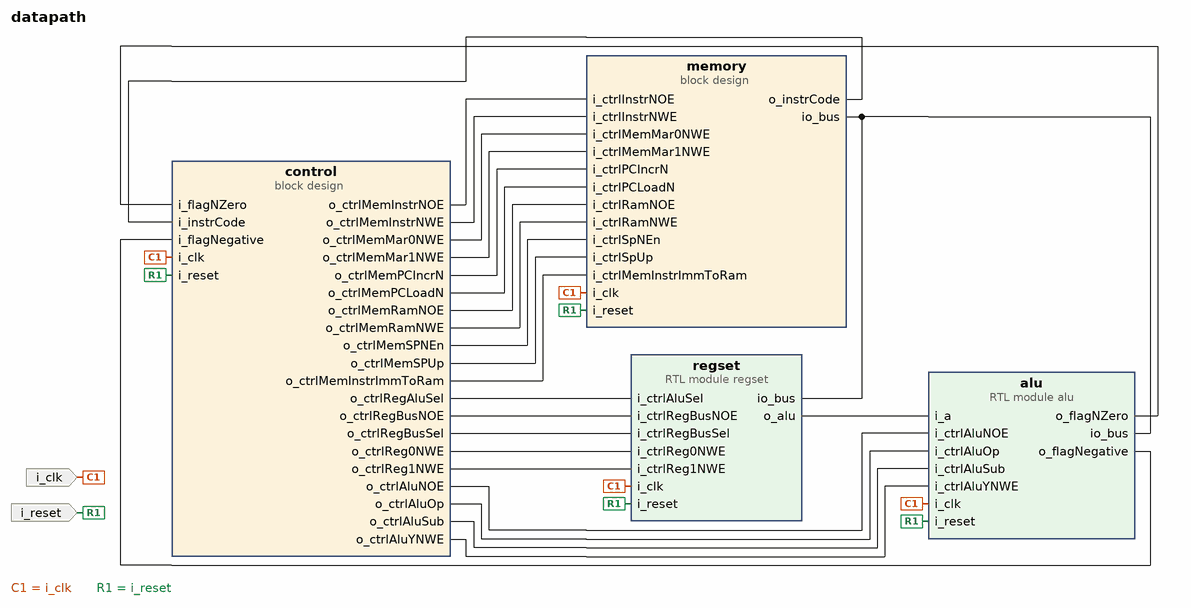
[diagram p0: block diagram of the top level]
# Vivado block design datapath, xc7a100tcsg324-3, Vivado 2021.1
create_bd_design datapath

create_bd_port -dir I -type clk i_clk
set_property -dict {CONFIG.PHASE 0.000} [get_bd_ports i_clk]
create_bd_port -dir I -type rst i_reset
set_property -dict {CONFIG.POLARITY ACTIVE_HIGH} [get_bd_ports i_reset]

create_bd_cell -type container -reference memory_bd memory
set_property -dict [list \
  CONFIG.ACTIVE_SIM_BD memory_bd.bd \
  CONFIG.ACTIVE_SYNTH_BD memory_bd.bd \
  CONFIG.ENABLE_DFX 0 \
  CONFIG.LIST_SIM_BD memory_bd.bd \
  CONFIG.LIST_SYNTH_BD memory_bd.bd \
  CONFIG.LOCK_PROPAGATE 0 \
] [get_bd_cells memory]
create_bd_cell -type module -reference regset regset
create_bd_cell -type container -reference control_bd control
set_property -dict [list \
  CONFIG.ACTIVE_SIM_BD control_bd.bd \
  CONFIG.ACTIVE_SYNTH_BD control_bd.bd \
  CONFIG.ENABLE_DFX 0 \
  CONFIG.LIST_SIM_BD control_bd.bd \
  CONFIG.LIST_SYNTH_BD control_bd.bd \
  CONFIG.LOCK_PROPAGATE 0 \
] [get_bd_cells control]
create_bd_cell -type module -reference alu alu

# ---- connections ----

connect_bd_net [get_bd_pins memory/io_bus] [get_bd_pins regset/io_bus] [get_bd_pins alu/io_bus]
connect_bd_net [get_bd_pins alu/o_flagNZero] [get_bd_pins control/i_flagNZero]
connect_bd_net [get_bd_pins alu/o_flagNegative] [get_bd_pins control/i_flagNegative]
connect_bd_net -net control_bd_0_o_ctrlAluNOE [get_bd_pins control/o_ctrlAluNOE] [get_bd_pins alu/i_ctrlAluNOE]
connect_bd_net -net control_bd_0_o_ctrlAluOp [get_bd_pins control/o_ctrlAluOp] [get_bd_pins alu/i_ctrlAluOp]
connect_bd_net -net control_bd_0_o_ctrlAluSub [get_bd_pins control/o_ctrlAluSub] [get_bd_pins alu/i_ctrlAluSub]
connect_bd_net -net control_bd_0_o_ctrlAluYNWE [get_bd_pins control/o_ctrlAluYNWE] [get_bd_pins alu/i_ctrlAluYNWE]
connect_bd_net -net control_bd_0_o_ctrlMemInstrNOE [get_bd_pins control/o_ctrlMemInstrNOE] [get_bd_pins memory/i_ctrlInstrNOE]
connect_bd_net -net control_bd_0_o_ctrlMemInstrNWE [get_bd_pins control/o_ctrlMemInstrNWE] [get_bd_pins memory/i_ctrlInstrNWE]
connect_bd_net -net control_bd_0_o_ctrlMemMar0NWE [get_bd_pins control/o_ctrlMemMar0NWE] [get_bd_pins memory/i_ctrlMemMar0NWE]
connect_bd_net -net control_bd_0_o_ctrlMemMar1NWE [get_bd_pins control/o_ctrlMemMar1NWE] [get_bd_pins memory/i_ctrlMemMar1NWE]
connect_bd_net -net control_bd_0_o_ctrlMemPCIncrN [get_bd_pins control/o_ctrlMemPCIncrN] [get_bd_pins memory/i_ctrlPCIncrN]
connect_bd_net -net control_bd_0_o_ctrlMemPCLoadN [get_bd_pins control/o_ctrlMemPCLoadN] [get_bd_pins memory/i_ctrlPCLoadN]
connect_bd_net -net control_bd_0_o_ctrlMemRamNOE [get_bd_pins control/o_ctrlMemRamNOE] [get_bd_pins memory/i_ctrlRamNOE]
connect_bd_net -net control_bd_0_o_ctrlMemRamNWE [get_bd_pins control/o_ctrlMemRamNWE] [get_bd_pins memory/i_ctrlRamNWE]
connect_bd_net -net control_bd_0_o_ctrlMemSPNEn [get_bd_pins control/o_ctrlMemSPNEn] [get_bd_pins memory/i_ctrlSpNEn]
connect_bd_net -net control_bd_0_o_ctrlMemSPUp [get_bd_pins control/o_ctrlMemSPUp] [get_bd_pins memory/i_ctrlSpUp]
connect_bd_net -net control_bd_0_o_ctrlRegAluSel [get_bd_pins control/o_ctrlRegAluSel] [get_bd_pins regset/i_ctrlAluSel]
connect_bd_net -net control_bd_0_o_ctrlRegBusNOE [get_bd_pins control/o_ctrlRegBusNOE] [get_bd_pins regset/i_ctrlRegBusNOE]
connect_bd_net -net control_bd_0_o_ctrlRegBusSel [get_bd_pins control/o_ctrlRegBusSel] [get_bd_pins regset/i_ctrlRegBusSel]
connect_bd_net -net control_bd_0_o_ctrlRegWr0 [get_bd_pins control/o_ctrlReg0NWE] [get_bd_pins regset/i_ctrlReg0NWE]
connect_bd_net -net control_bd_0_o_ctrlRegWr1 [get_bd_pins control/o_ctrlReg1NWE] [get_bd_pins regset/i_ctrlReg1NWE]
connect_bd_net [get_bd_pins control/o_ctrlMemInstrImmToRam] [get_bd_pins memory/i_ctrlMemInstrImmToRam]
connect_bd_net -net i_clk_0_1 [get_bd_ports i_clk] \
  [get_bd_pins memory/i_clk] [get_bd_pins regset/i_clk] [get_bd_pins control/i_clk] [get_bd_pins alu/i_clk]
connect_bd_net -net i_reset_0_1 [get_bd_ports i_reset] \
  [get_bd_pins memory/i_reset] [get_bd_pins regset/i_reset] [get_bd_pins control/i_reset] [get_bd_pins alu/i_reset]
connect_bd_net [get_bd_pins memory/o_instrCode] [get_bd_pins control/i_instrCode]
connect_bd_net -net regset_0_o_alu [get_bd_pins regset/o_alu] [get_bd_pins alu/i_a]

validate_bd_design
save_bd_design
